# EAGLE design SHT10-Adapter (EAGLE 6.5.0)
Assembly variants: Atmega + TH, P, L, Atmega + TH, Atmega + TH, L, Arduino + TH, P, L, Arduino + TH, Arduino + TH, L
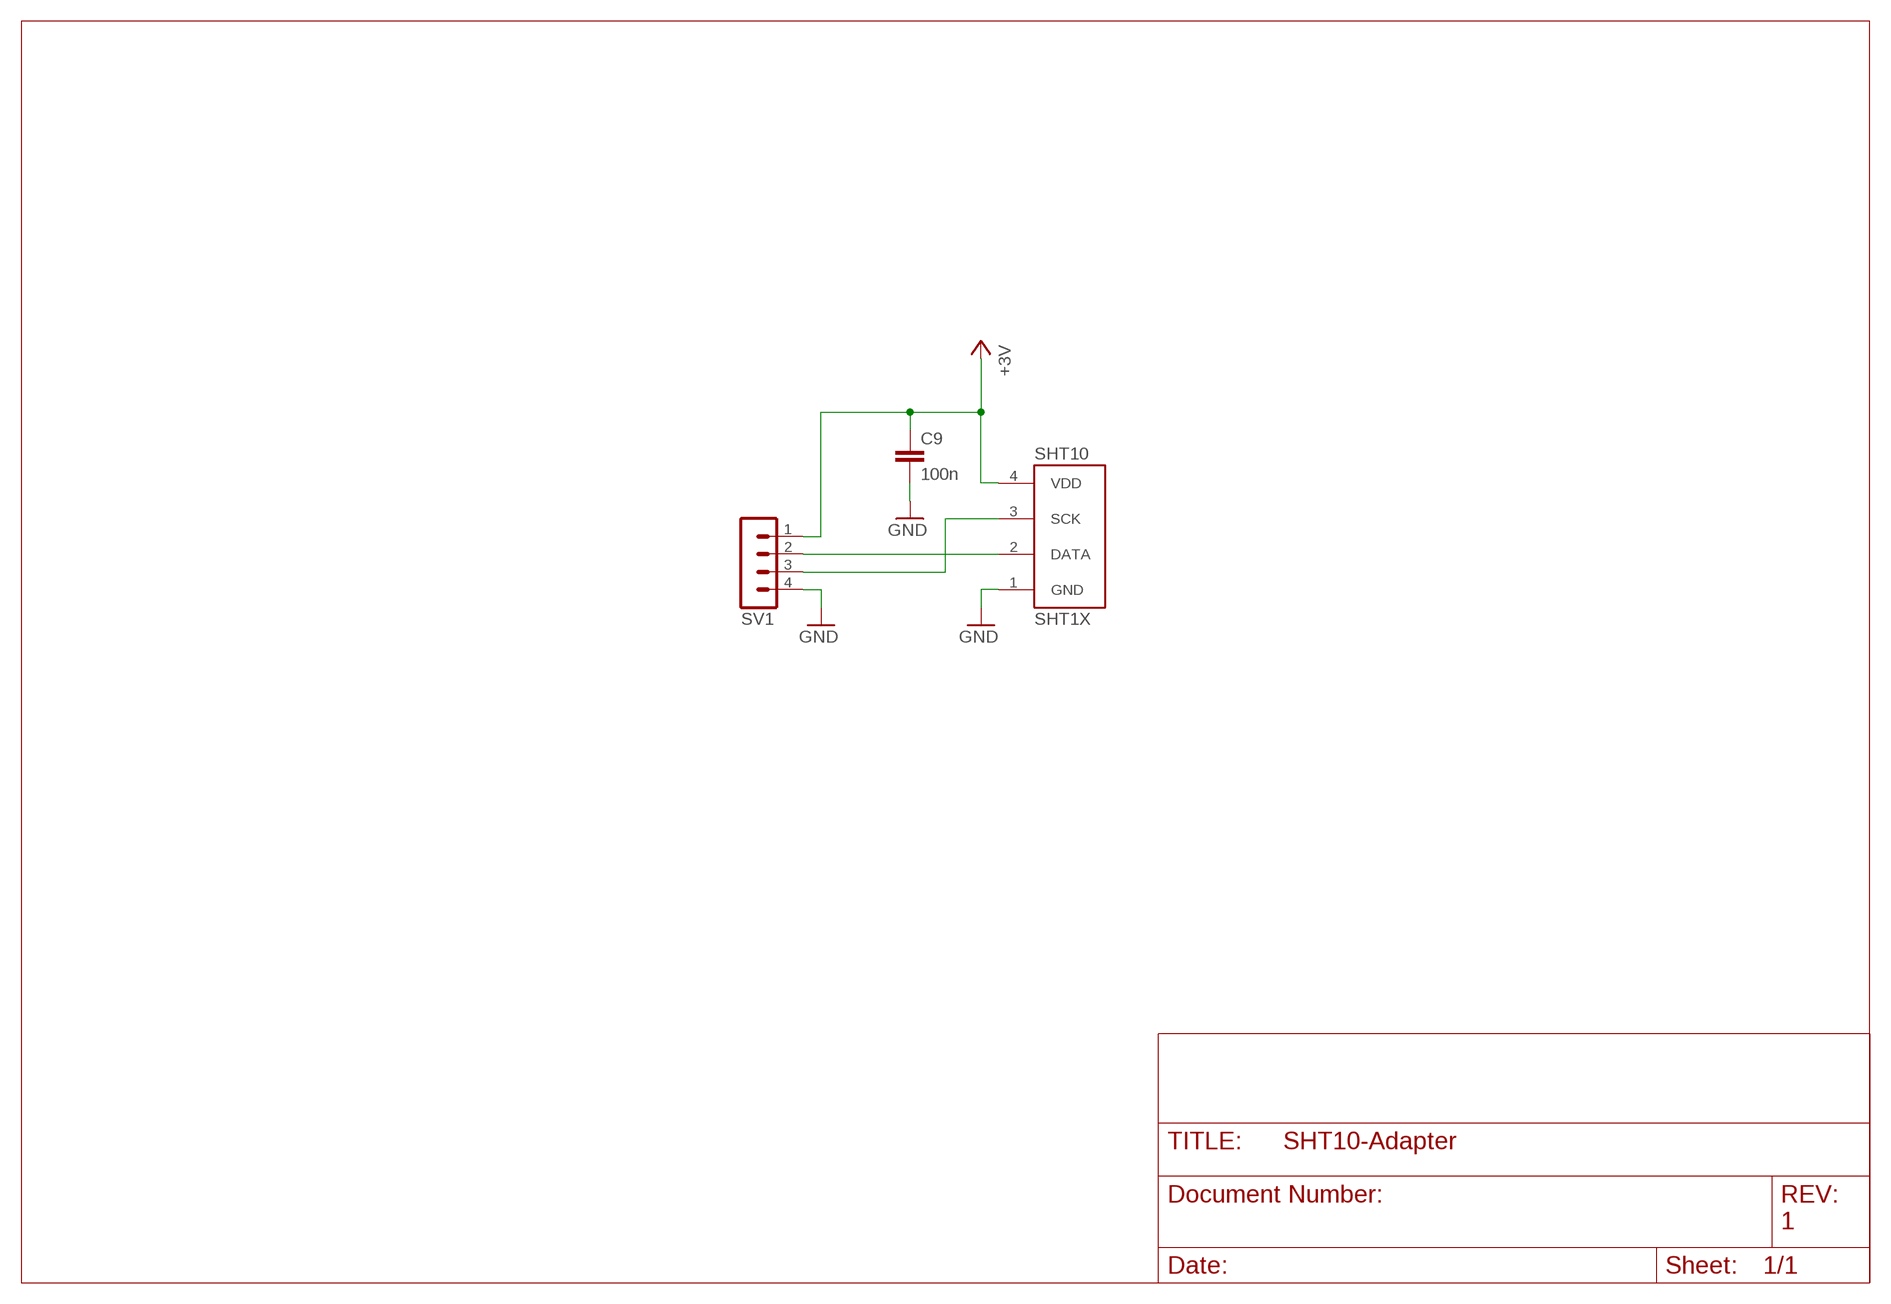
[diagram p0: schematic, sheet 1]

## Parts
C9  100n  C-EUC0805  [C0805]
SHT10  SHT1X  [SHT1X]
SV1  MA04-1  [MA04-1]

## Nets
GND: C9.2 SHT10.1(GND) SV1.4
SCL: SHT10.3(SCK) SV1.3
SDA: SHT10.2(DATA) SV1.2
VCC: C9.1 SHT10.4(VDD) SV1.1 ; supply symbol labelled +3V

## Notes on the sheet
- 1

## Library data of the parts
C9 = rcl:C-EU: CAPACITOR, European symbol
SHT10 = sht10_11_15:SHT1X
SV1 = con-lstb:MA04-1: PIN HEADER; OC_FARNELL: unknown; OC_NEWARK: unknown

## Net classes
1 vcc: width 0.254 mm

## Board
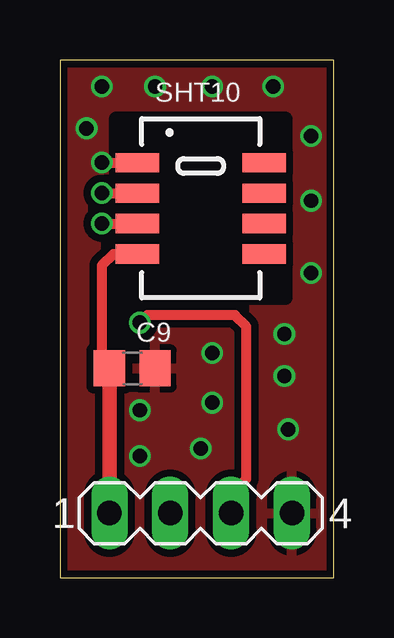
[diagram p1: board, top side]
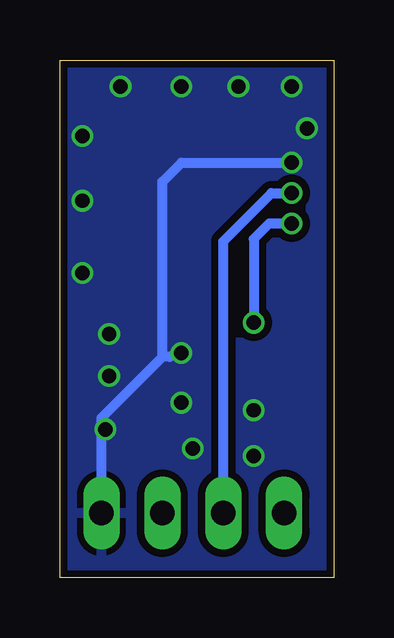
[diagram p2: board, bottom side, seen from below]

Size 11.42 x 21.58 mm. Coordinates in mm from the lower left corner, seen from the top.
Outline: 0,0 11.42,0 11.42,21.58 0,21.58 0,0
Copper layers (1*16): Top 0.035mm / dielectric 1.5mm / Bottom 0.035mm
Design rules "ITEADstudio_DRC": minimum track width 6mil, minimum drill 12mil, track to track 6mil, track to pad 6mil, pad to pad 6mil, via to via 6mil, smd to smd 0mil, copper to edge 10mil, drill to drill 10mil, minimum pad ring 10mil, minimum via ring 6mil, stop-mask expansion 2mil, vias tented up to drill 100mil, thermal gap 10mil

### Footprints (pad centres in the part's own frame; a part is rotated, then mirrored left to right if it is on the bottom)
C0805 = smd 1.3 x 1.5: 1 -0.95,0; 2 0.95,0
SHT1X = smd 1.803 x 0.8: 1 -2.642,1.905; 2 -2.642,0.635; 3 -2.642,-0.635; 4 -2.642,-1.905; 5 2.642,-1.905; 6 2.642,-0.635; 7 2.642,0.635; 8 2.642,1.905
MA04-1 = drill 1.016 long: 1 -3.81,0; 2 -1.27,0; 3 1.27,0; 4 3.81,0

### Placement (x,y rotation side)
C9  3.02,8.73 0 top
SHT10  5.87,15.4 0 top
SV1  5.87,2.7 0 top

### Tracks (layer width: path | path; a pad name or v marks a point on that pad's centre or on a via)
GND  (via drill 0.6)
  Top 0.406: v1.75,17.3 SHT10.1
  Bottom 0.406: SV1.4 9.68,6.67 7.14,9.21 | 7.14,9.21 7.14,16.51 6.35,17.3 v1.75,17.3 | 6.83,9.21 7.14,9.21
  other vias: 1.75,20.48 3.97,20.48 6.35,20.48 8.89,20.48 10.48,18.41 10.48,15.72 10.48,12.7 9.37,10.16 9.37,8.41 9.52,6.19 5.87,5.4 6.35,7.3 6.35,9.37 3.33,6.99 3.33,5.08 1.11,18.73
  pour Bottom (isolate 0.305): 0,21.59 11.43,21.75 11.43,0.16 0,0
  pour Top (isolate 0.305): 0,21.59 11.43,21.75 11.43,0.16 0,0
SCL  (via drill 0.6)
  Top 0.406: SV1.3 7.14,3.49 7.78,4.13 7.78,10.48 7.3,10.95 3.65,10.95 v3.33,10.64 | v1.75,14.76 SHT10.3
  Bottom 0.406: v1.75,14.76 2.7,14.76 3.33,14.13 v3.33,10.64
SDA  (via drill 0.6)
  Top 0.406: v1.75,16.03 SHT10.2
  Bottom 0.406: SV1.2 4.6,14.03 2.6,16.03 v1.75,16.03
VCC
  Top 0.406: SHT10.4 2.22,13.49 1.75,13.02 1.75,9.05 C9.1
  Top 0.61: C9.1 SV1.1